# Altium schematic sheet Sheet1.SchDoc
size A
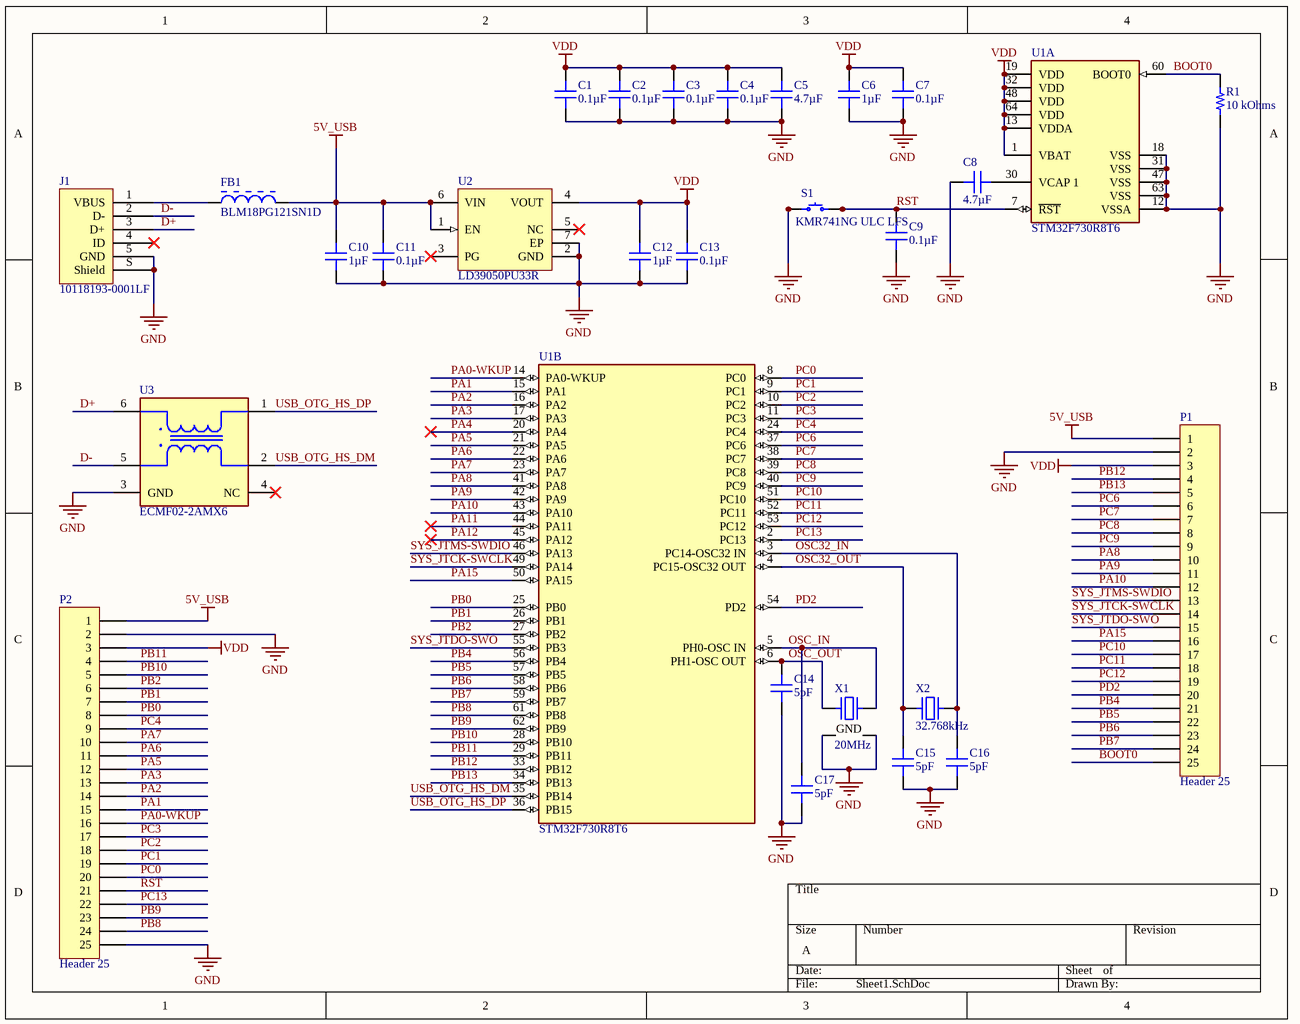
[diagram p0: Sheet1.SchDoc]

## Parts
C1  0.1µF  [CAP 0603_1608]
C2  0.1µF  [CAP 0603_1608]
C3  0.1µF  [CAP 0603_1608]
C4  0.1µF  [CAP 0603_1608]
C5  4.7µF  [CAP 0603_1608]
C6  1µF  [CAP 0603_1608]
C7  0.1µF  [CAP 0603_1608]
C8  4.7µF  [CAP 0603_1608]
C9  0.1µF  [CAP 0603_1608]
C10  1µF  [CAP 0603_1608]
C11  0.1µF  [CAP 0603_1608]
C12  1µF  [CAP 0603_1608]
C13  0.1µF  [CAP 0603_1608]
C14  5pF  [CAP 0603_1608]
C15  5pF  [CAP 0603_1608]
C16  5pF  [CAP 0603_1608]
C17  5pF  [CAP 0603_1608]
FB1  BLM18PG121SN1D  [MURA-BLM18PG_KG-B25-CHIP-2_V1]
J1  10118193-0001LF  [FCI USB 10118193-0001LF]
P1  Header 25  [HDR1X25]
P2  Header 25  [HDR1X25]
R1  10 kOhms  [RES 0603_1608]
S1  KMR741NG ULC LFS  [C&K KMR7]
U1  STM32F730R8T6  [FP-LQFP64-5W-IPC_C]  (parts A,B of 2)
U2  LD39050PU33R  [DFN6D_L]
U3  ECMF02-2AMX6  [FP-QFN-6L-MFG]
X1  20MHz  [NDK NX3225SA]
X2  32.768kHz  [ABRACON ABS06]

## Nets
5V_USB: C10.2 C11.2 FB1.2 P1.1 P2.1 U2.1(EN) U2.6(VIN)
GND: C1.1 C2.1 C3.1 C4.1 C5.1 C6.2 C7.2 C8.2 C9.2 C10.1 C11.1 C12.1 C13.2 C14.1 C15.1 C16.1 C17.1 J1.5(GND) J1.S(Shield) P1.2 P2.2 P2.25 R1.1 S1.1 S1.2 U1.12(VSSA) U1.18(VSS) U1.31(VSS) U1.47(VSS) U1.63(VSS) U2.2(GND) U2.7(EP) U3.3(GND) X1.2(GND) X1.4(GND)
VDD: C1.2 C2.2 C3.2 C4.2 C5.2 C6.1 C7.1 C12.2 C13.1 P1.3 P2.3 U1.1(VBAT) U1.13(VDDA) U1.19(VDD) U1.32(VDD) U1.48(VDD) U1.64(VDD) U2.4(VOUT)
BOOT0: P1.25 R1.2 U1.60(BOOT0)
D+: J1.3(D+) U3.6(D+)
D-: J1.2(D-) U3.5(D-)
OSC32_IN: C16.2 U1.3(PC14-OSC32_IN) X2.2
OSC32_OUT: C15.2 U1.4(PC15-OSC32_OUT) X2.1
OSC_IN: C17.2 U1.5(PH0-OSC_IN) X1.3
OSC_OUT: C14.2 U1.6(PH1-OSC_OUT) X1.1
PA0-WKUP: P2.16 U1.14(PA0-WKUP)
PA1: P2.15 U1.15(PA1)
PA2: P2.14 U1.16(PA2)
PA3: P2.13 U1.17(PA3)
PA4: U1.20(PA4)
PA5: P2.12 U1.21(PA5)
PA6: P2.11 U1.22(PA6)
PA7: P2.10 U1.23(PA7)
PA8: P1.10 U1.41(PA8)
PA9: P1.11 U1.42(PA9)
PA10: P1.12 U1.43(PA10)
PA11: U1.44(PA11)
PA12: U1.45(PA12)
PA15: P1.16 U1.50(PA15)
PB0: P2.8 U1.25(PB0)
PB1: P2.7 U1.26(PB1)
PB2: P2.6 U1.27(PB2)
PB4: P1.21 U1.56(PB4)
PB5: P1.22 U1.57(PB5)
PB6: P1.23 U1.58(PB6)
PB7: P1.24 U1.59(PB7)
PB8: P2.24 U1.61(PB8)
PB9: P2.23 U1.62(PB9)
PB10: P2.5 U1.28(PB10)
PB11: P2.4 U1.29(PB11)
PB12: P1.4 U1.33(PB12)
PB13: P1.5 U1.34(PB13)
PC0: P2.20 U1.8(PC0)
PC1: P2.19 U1.9(PC1)
PC2: P2.18 U1.10(PC2)
PC3: P2.17 U1.11(PC3)
PC4: P2.9 U1.24(PC4)
PC6: P1.6 U1.37(PC6)
PC7: P1.7 U1.38(PC7)
PC8: P1.8 U1.39(PC8)
PC9: P1.9 U1.40(PC9)
PC10: P1.17 U1.51(PC10)
PC11: P1.18 U1.52(PC11)
PC12: P1.19 U1.53(PC12)
PC13: P2.22 U1.2(PC13)
PD2: P1.20 U1.54(PD2)
RST: C9.1 P2.21 S1.3 S1.4 U1.7(~{RST})
SYS_JTCK-SWCLK: P1.14 U1.49(PA14)
SYS_JTDO-SWO: P1.15 U1.55(PB3)
SYS_JTMS-SWDIO: P1.13 U1.46(PA13)
USB_OTG_HS_DM: U1.35(PB14) U3.2(D-)
USB_OTG_HS_DP: U1.36(PB15) U3.1(D+)
NetC8_1: C8.1 U1.30(VCAP_1)
NetFB1_1: FB1.1 J1.1(VBUS)

Not connected (* = marked no-connect by the designer): J1 4(ID)*; U2 3(PG)* 5(NC)*; U3 4(NC)*

## Library data of the parts
C1-C4 C7 C9 C11 C13 = 06033C104KAZ2A: CAP CER 0.1UF 25V X7R 0603; Manufacturer: AVX Corporation; Tolerance: ±10%; Part Number: 06033C104KAZ2A; Value: 0.1µF; Applications: Boardflex Sensitive; Capacitance: 0.1µF; ComponentLink1Description: Datasheet; ComponentLink1URL: http://datasheets.avx.com/FlexitermMLCC.pdf; ComponentLink2Description: DigiKey Link; ComponentLink2URL: http://digikey.com/product-detail/en/avx-corporation/06033C104KAZ2A/478-3539-1-ND/1024892; Device Package: 0603 (1608 Metric); Features: Soft Termination; LastUpdated: 9/2/2020 1:03:14 AM; Lifecycle Status: Active; Minimum Order: 1; Mounting Type: Surface Mount, MLCC; Operating Temperature: -55°C ~ 125°C; Package / Case: 0603 (1608 Metric); Packaging: TapeAndReel; PartId: 14079; Part Status: Active; Price: 0.03; Series: FLEXITERM®; Size / Dimension: 0.063" L x 0.032" W (1.60mm x 0.81mm); Supplier 1: DigiKey; Supplier Part Number 1: 478-3539-1-ND; Temperature Coefficient: X7R; Thickness (Max): 0.035" (0.90mm); Voltage - Rated: 25V
C5 C8 = GRM188C71C475KE21D: CAP CER 4.7UF 16V X7S 0603; Manufacturer: Murata Electronics; Tolerance: ±10%; Part Number: GRM188C71C475KE21D; Value: 4.7µF; Applications: General Purpose; Capacitance: 4.7µF; ComponentLink1Description: Datasheet; ComponentLink1URL: https://search.murata.co.jp/Ceramy/image/img/A01X/G101/ENG/GRM188C71C475KE21-01.pdf; ComponentLink2Description: DigiKey Link; ComponentLink2URL: http://digikey.com/product-detail/en/murata-electronics/GRM188C71C475KE21D/490-16337-1-ND/7363319; Device Package: 0603 (1608 Metric); LastUpdated: 9/2/2020 1:03:25 AM; Lifecycle Status: Active; Minimum Order: 1; Mounting Type: Surface Mount, MLCC; Operating Temperature: -55°C ~ 125°C; Package / Case: 0603 (1608 Metric); Packaging: TapeAndReel; PartId: 8303; Part Status: Active; Price: 0.08; Series: GRM; Size / Dimension: 0.063" L x 0.031" W (1.60mm x 0.80mm); Supplier 1: DigiKey; Supplier Part Number 1: 490-16337-1-ND; Temperature Coefficient: X7S; Thickness (Max): 0.035" (0.90mm); Voltage - Rated: 16V
C6 C10 C12 = 06033C105KAT4A: CAP CER 1UF 25V X7R 0603; Manufacturer: AVX Corporation; Tolerance: ±10%; Part Number: 06033C105KAT4A; Value: 1µF; Applications: General Purpose; Capacitance: 1µF; ComponentLink1Description: Datasheet; ComponentLink1URL: http://datasheets.avx.com/X7RDielectric.pdf; ComponentLink2Description: DigiKey Link; ComponentLink2URL: http://digikey.com/product-detail/en/avx-corporation/06033C105KAT4A/478-11508-1-ND/8107709; Device Package: 0603 (1608 Metric); LastUpdated: 9/2/2020 1:03:22 AM; Lifecycle Status: Active; Minimum Order: 1; Mounting Type: Surface Mount, MLCC; Operating Temperature: -55°C ~ 125°C; Package / Case: 0603 (1608 Metric); Packaging: TapeAndReel; PartId: 10070; Part Status: Active; Price: 0.06; Series: -; Size / Dimension: 0.063" L x 0.032" W (1.60mm x 0.81mm); Supplier 1: DigiKey; Supplier Part Number 1: 478-11508-1-ND; Temperature Coefficient: X7R; Thickness (Max): 0.037" (0.94mm); Voltage - Rated: 25V
C14-C17 = CBR06C509A5GAC: CAP CER 5PF 50V NP0 0603; Manufacturer: KEMET; Temperature Coefficient: C0G, NP0; Tolerance: ±0.05pF; Part Number: CBR06C509A5GAC; Value: 5pF; Applications: RF, Microwave, High Frequency; Capacitance: 5pF; ComponentLink1Description: Datasheet; ComponentLink1URL: https://api.kemet.com/component-edge/download/datasheet/CBR06C509A5GAC.pdf; ComponentLink2Description: DigiKey Link; ComponentLink2URL: http://digikey.com/product-detail/en/kemet/CBR06C509A5GAC/399-17323-1-ND/8602597; Device Package: 0603 (1608 Metric); Features: High Q, Low Loss, Ultra Low ESR; LastUpdated: 9/2/2020 1:03:29 AM; Lifecycle Status: Active; Minimum Order: 1; Mounting Type: Surface Mount, MLCC; Operating Temperature: -55°C ~ 125°C; Package / Case: 0603 (1608 Metric); Packaging: TapeAndReel; PartId: 6420; Part Status: Active; Price: 0.09; Series: CBR-SMD RF C0G; Size / Dimension: 0.063" L x 0.031" W (1.60mm x 0.80mm); Supplier 1: DigiKey; Supplier Part Number 1: 399-17323-1-ND; Thickness (Max): 0.034" (0.87mm); Voltage - Rated: 50V
FB1 = CMP-0686-00557-6: Chip Ferrite Bead for Power Lines, 120 Ohm, 2000 mA, -55 to 125 degC, 1.6 x 0.8 x 0.95 mm SMD, Tape and Reel; Manufacturer: Murata; Impedance (at 100 MHz): 120 Ohm +/- 25%; Rated Current: 2000 mA; DC Resistance: 0.05 Ohm Max.; DatasheetVersion: 08/2013; PackageDescription: 2-Pin Chip, Body 1.6 x 0.8 mm; ComponentLink3URL: http://www.murata.com/products/catalog/pdf/c31e.pdf; PartNumber: BLM18PG121SN1D; ComponentLink1URL: http://www.murata.com/; ComponentLink2Description: Datasheet; Mounting Technology: Surface Mount; ComponentLink1Description: Manufacturer URL; PackageReference: BLM18_H950-2; ComponentLink2URL: http://www.murata.com/products/catalog/pdf/c31e.pdf; ComponentLink3Description: Package Specification; Packing: Tape and Reel; Operating Temperature Range: -55 to 125 degC
J1 = 10118193-0001LF: CONN RCPT USB2.0 MICRO B SMD R/A; Manufacturer: Amphenol ICC (FCI); Connector Type: USB - micro B; Current Rating (Amps): 1.8A per Contact; Gender: Receptacle; Mating Cycles: 10000; Number of Contacts: 5; Number of Ports: 1; Shielding: Shielded; Voltage - Rated: 100VAC; Part Number: 10118193-0001LF; ComponentLink1Description: Datasheet; ComponentLink1URL: https://cdn.amphenol-icc.com/media/wysiwyg/files/documentation/datasheet/inputoutput/io_usb_micro.pdf; ComponentLink2Description: DigiKey Link; ComponentLink2URL: //digikey.com/product-detail/en/amphenol-icc-fci/10118193-0001LF/609-4616-2-ND/2785388; Features: Solder Retention; LastUpdated: 12/9/2019 8:51:28 PM; Lifecycle Status: 0; Minimum Order: 1; Mounting Feature: Horizontal; Mounting Type: Surface Mount, Right Angle; Through Hole; Operating Temperature: -30°C ~ 80°C; Packaging: TapeAndReel; Part Status: Active; Price: 0.21; Series: -; Specifications: USB 2.0; Supplier 1: DigiKey; Supplier Part Number 1: 609-4616-2-ND; Termination: Solder
P1 P2 = Header 25: Header, 25-Pin; LatestRevisionDate: 17-Jul-2002; LatestRevisionNote: Re-released for DXP Platform.; Publisher: Altium Limited
R1 = ERJ-PA3F1002V: RES SMD 10K OHM 1% 1/4W 0603; Manufacturer: Panasonic Electronic Components; Power (Watts): 0.25W, 1/4W; Temperature Coefficient: ±100ppm/°C; Part Number: ERJ-PA3F1002V; Value: 10 kOhms; ComponentLink1Description: Datasheet; ComponentLink1URL: https://industrial.panasonic.com/cdbs/www-data/pdf/RDO0000/AOA0000C331.pdf; ComponentLink2Description: DigiKey Link; ComponentLink2URL: http://digikey.com/product-detail/en/panasonic-electronic-components/ERJ-PA3F1002V/P10KBYCT-ND/5036115; Composition: Thick Film; Device Package: 0603 (1608 Metric); Features: Automotive AEC-Q200, Pulse Withstanding; Height - Seated (Max): 0.022" (0.55mm); LastUpdated: 9/2/2020 1:10:04 AM; Lifecycle Status: Active; Minimum Order: 1; Number of Terminations: 2; Operating Temperature: -55°C ~ 155°C; Package / Case: 0603 (1608 Metric); Packaging: TapeAndReel; PartId: 14698; Part Status: Active; Price: 0.02; Ratings: AEC-Q200; Resistance: 10 kOhms; Series: ERJ; Size / Dimension: 0.063" L x 0.031" W (1.60mm x 0.80mm); Supplier 1: DigiKey; Supplier Part Number 1: P10KBYCT-ND; Supplier Device Package: 0603; Tolerance: ±1%
S1 = KMR741NG ULC LFS: SWITCH TACTILE SPST-NO 50MA 32V; Manufacturer: C&K; Actuator Height off PCB, Vertical: 2.50mm; Actuator Orientation: Top Actuated; Actuator Type: Standard; Contact Rating @ Voltage: 0.05A @ 32VDC; Illumination: Non-Illuminated; Ingress Protection: IP67 - Dust Tight, Waterproof; Operating Force: 400gf; Outline: 4.20mm x 2.80mm; Switch Function: Off-Mom; Part Number: KMR741NG ULC LFS; Circuit: SPST-NO; ComponentLink1Description: Datasheet; ComponentLink1URL: https://dznh3ojzb2azq.cloudfront.net/products/Tactile/KMR7/documents/datasheet.pdf; ComponentLink2Description: DigiKey Link; ComponentLink2URL: http://digikey.com/product-detail/en/c-k/KMR741NG-ULC-LFS/CKN10688CT-ND/6035360; LastUpdated: 4/9/2020 10:01:05 AM; Lifecycle Status: Active; Minimum Order: 1; Mounting Type: Surface Mount; Operating Temperature: -40°C ~ 85°C; Packaging: TapeAndReel; Part Status: Active; Price: 0.16; Series: KMR7; Supplier 1: DigiKey; Supplier Part Number 1: CKN10688CT-ND; Termination Style: Gull Wing
U1 = STM32F730R8T6: STMICROELECTRONICS - STM32F730R8T6 - ARM MCU, STM32 Family STM32F7 Series Microcontrollers, ARM Cortex-M7, 32bit, 216 MHz, 64 KB, 256 KB; Supplier 1: Newark; Manufacturer: STMicroelectronics; Manufacturer Part Number: STM32F730R8T6; RoHS: No; Category: Microcontrollers; Stock 1: 20; Pricing 1: 1=4.30000, 10=3.73000, 25=3.59000, 50=3.44000, 100=3.30000, 250=3.15000, 500=2.87000 (USD); ComponentLink1URL: http://www.farnell.com/datasheets/2710920.pdf?src-supplier=Farnell; ComponentLink1Description: http://www.farnell.com/datasheets/2710920.pdf?src-supplier=Farnell; ComponentLink2URL: https://www.st.com/resource/en/errata_sheet/dm00305994.pdf?src-supplier=Digi-Key; ComponentLink2Description: https://www.st.com/resource/en/errata_sheet/dm00305994.pdf?src-supplier=Digi-Key; Supplier Part Number 1: 84AC2893
U2 = CMP-0244-00288-1: 500 mA Low Quiescent Current Low Noise Voltage Regulator, 3.3V, 6-Pin VDFDPN, Tape and Reel; PackageReference: DFN6D; ComponentLink1Description: Manufacturer URL; ComponentLink1URL: http://www.st.com; PackageVersion: 2008; PackageDescription: 6-Pin Plastic, Dual LLP, 3 x 3 mm Body, 0.95 mm Pitch, Exposed Pad; ComponentLink2URL: http://www.st.com/internet/com/TECHNICAL_RESOURCES/TECHNICAL_LITERATURE/DATASHEET/CD00227527.pdf; DatasheetVersion: 1/03/2009; ComponentLink2Description: Datasheet
U3 = CMP-12075-000001-1: CMC 200MA 2LN SMD ESD; Manufacturer: STMicroelectronics; Standoff Height: 0mm; Max Junction Temp: +125°C; Series Resistance: 2.5Ω; Device Class L2: EMI / RFI Components; Device Class L1: Passive Components; Height: 0.55mm; Lead Free: Yes; Package: QFN-6L; Temperature Range Low: -55°C; Octopart: https://octopart.com/ecmf02-2amx6-stmicroelectronics-44353078; Mouser Description: TVS Diodes / ESD Suppressors ESD Mode Filter 6GHz USB 2.0 MIPI 8kV; Device Class L3: Common Mode Chokes; ComponentLink2URL: https://www.st.com/resource/en/datasheet/ecmf02-2amx6.pdf; Ipc Land Pattern Name: DFN170X150X50-6; ComponentLink2Description: Datasheet; Automotive: No; Temperature Range High: +125°C; Temperature: -55°C to +125°C; RoHS: TRUE; Digikey Description: CMC 200MA 2LN SMD ESD; Manufacturer Part Number: ECMF02-2AMX6; Category: Filter
X1 = NX3225SA-20.000M-STD-CSR-1: CRYSTAL 20.0000MHZ 8PF SMD; Manufacturer: NDK America, Inc.; ESR (Equivalent Series Resistance): 50 Ohms; Frequency Stability: ±15ppm; Operating Mode: Fundamental; Part Number: NX3225SA-20.000M-STD-CSR-1; ComponentLink1Description: Datasheet; ComponentLink1URL: //media.digikey.com/pdf/Data%20Sheets/NDK%20PDFs/NX3225SA.pdf; ComponentLink2Description: DigiKey Link; ComponentLink2URL: http://digikey.com/product-detail/en/ndk-america-inc/NX3225SA-20.000M-STD-CSR-1/644-1050-1-ND/1128922; Frequency: 20MHz; Frequency Tolerance: ±15ppm; Height - Seated (Max): 0.024" (0.60mm); LastUpdated: 9/2/2020 1:21:59 AM; Lifecycle Status: Active; Load Capacitance: 8pF; Minimum Order: 1; Mounting Type: Surface Mount; Operating Temperature: -10°C ~ 75°C; Package / Case: 4-SMD, No Lead; Packaging: TapeAndReel; PartId: 604; Part Status: Active; Price: 0.38; Series: NX3225SA; Size / Dimension: 0.126" L x 0.098" W (3.20mm x 2.50mm); Supplier 1: DigiKey; Supplier Part Number 1: 644-1050-1-ND; Type: MHz Crystal; Value: 20MHz
X2 = ABS06-127-32.768KHZ-T: IOT 32.786KHZ XTAL; Manufacturer: Abracon LLC; ESR (Equivalent Series Resistance): 90 kOhms; Frequency Tolerance: ±20ppm; Load Capacitance: 12.5pF; Operating Mode: Fundamental; Part Number: ABS06-127-32.768KHZ-T; ComponentLink1Description: Datasheet; ComponentLink1URL: https://abracon.com/datasheets/ABS06-127-32.768kHz-T.pdf; ComponentLink2Description: DigiKey Link; ComponentLink2URL: http://digikey.com/product-detail/en/abracon-llc/ABS06-127-32.768KHZ-T/535-14513-1-ND/8827204; Frequency: 32.768kHz; Height - Seated (Max): 0.024" (0.60mm); LastUpdated: 9/2/2020 1:21:46 AM; Lifecycle Status: Active; Minimum Order: 1; Mounting Type: Surface Mount; Operating Temperature: -40°C ~ 85°C; Package / Case: 2-SMD, No Lead; Packaging: TapeAndReel; PartId: 374; Part Status: Active; Price: 0.36; Series: ABS06; Size / Dimension: 0.079" L x 0.047" W (2.00mm x 1.20mm); Supplier 1: DigiKey; Supplier Part Number 1: 535-14513-1-ND; Type: kHz Crystal (Tuning Fork); Value: 32.768kHz